# Altium schematic sheet USBC-UART.SchDoc
size A3; SheetNumber: 2; SheetTotal: 5
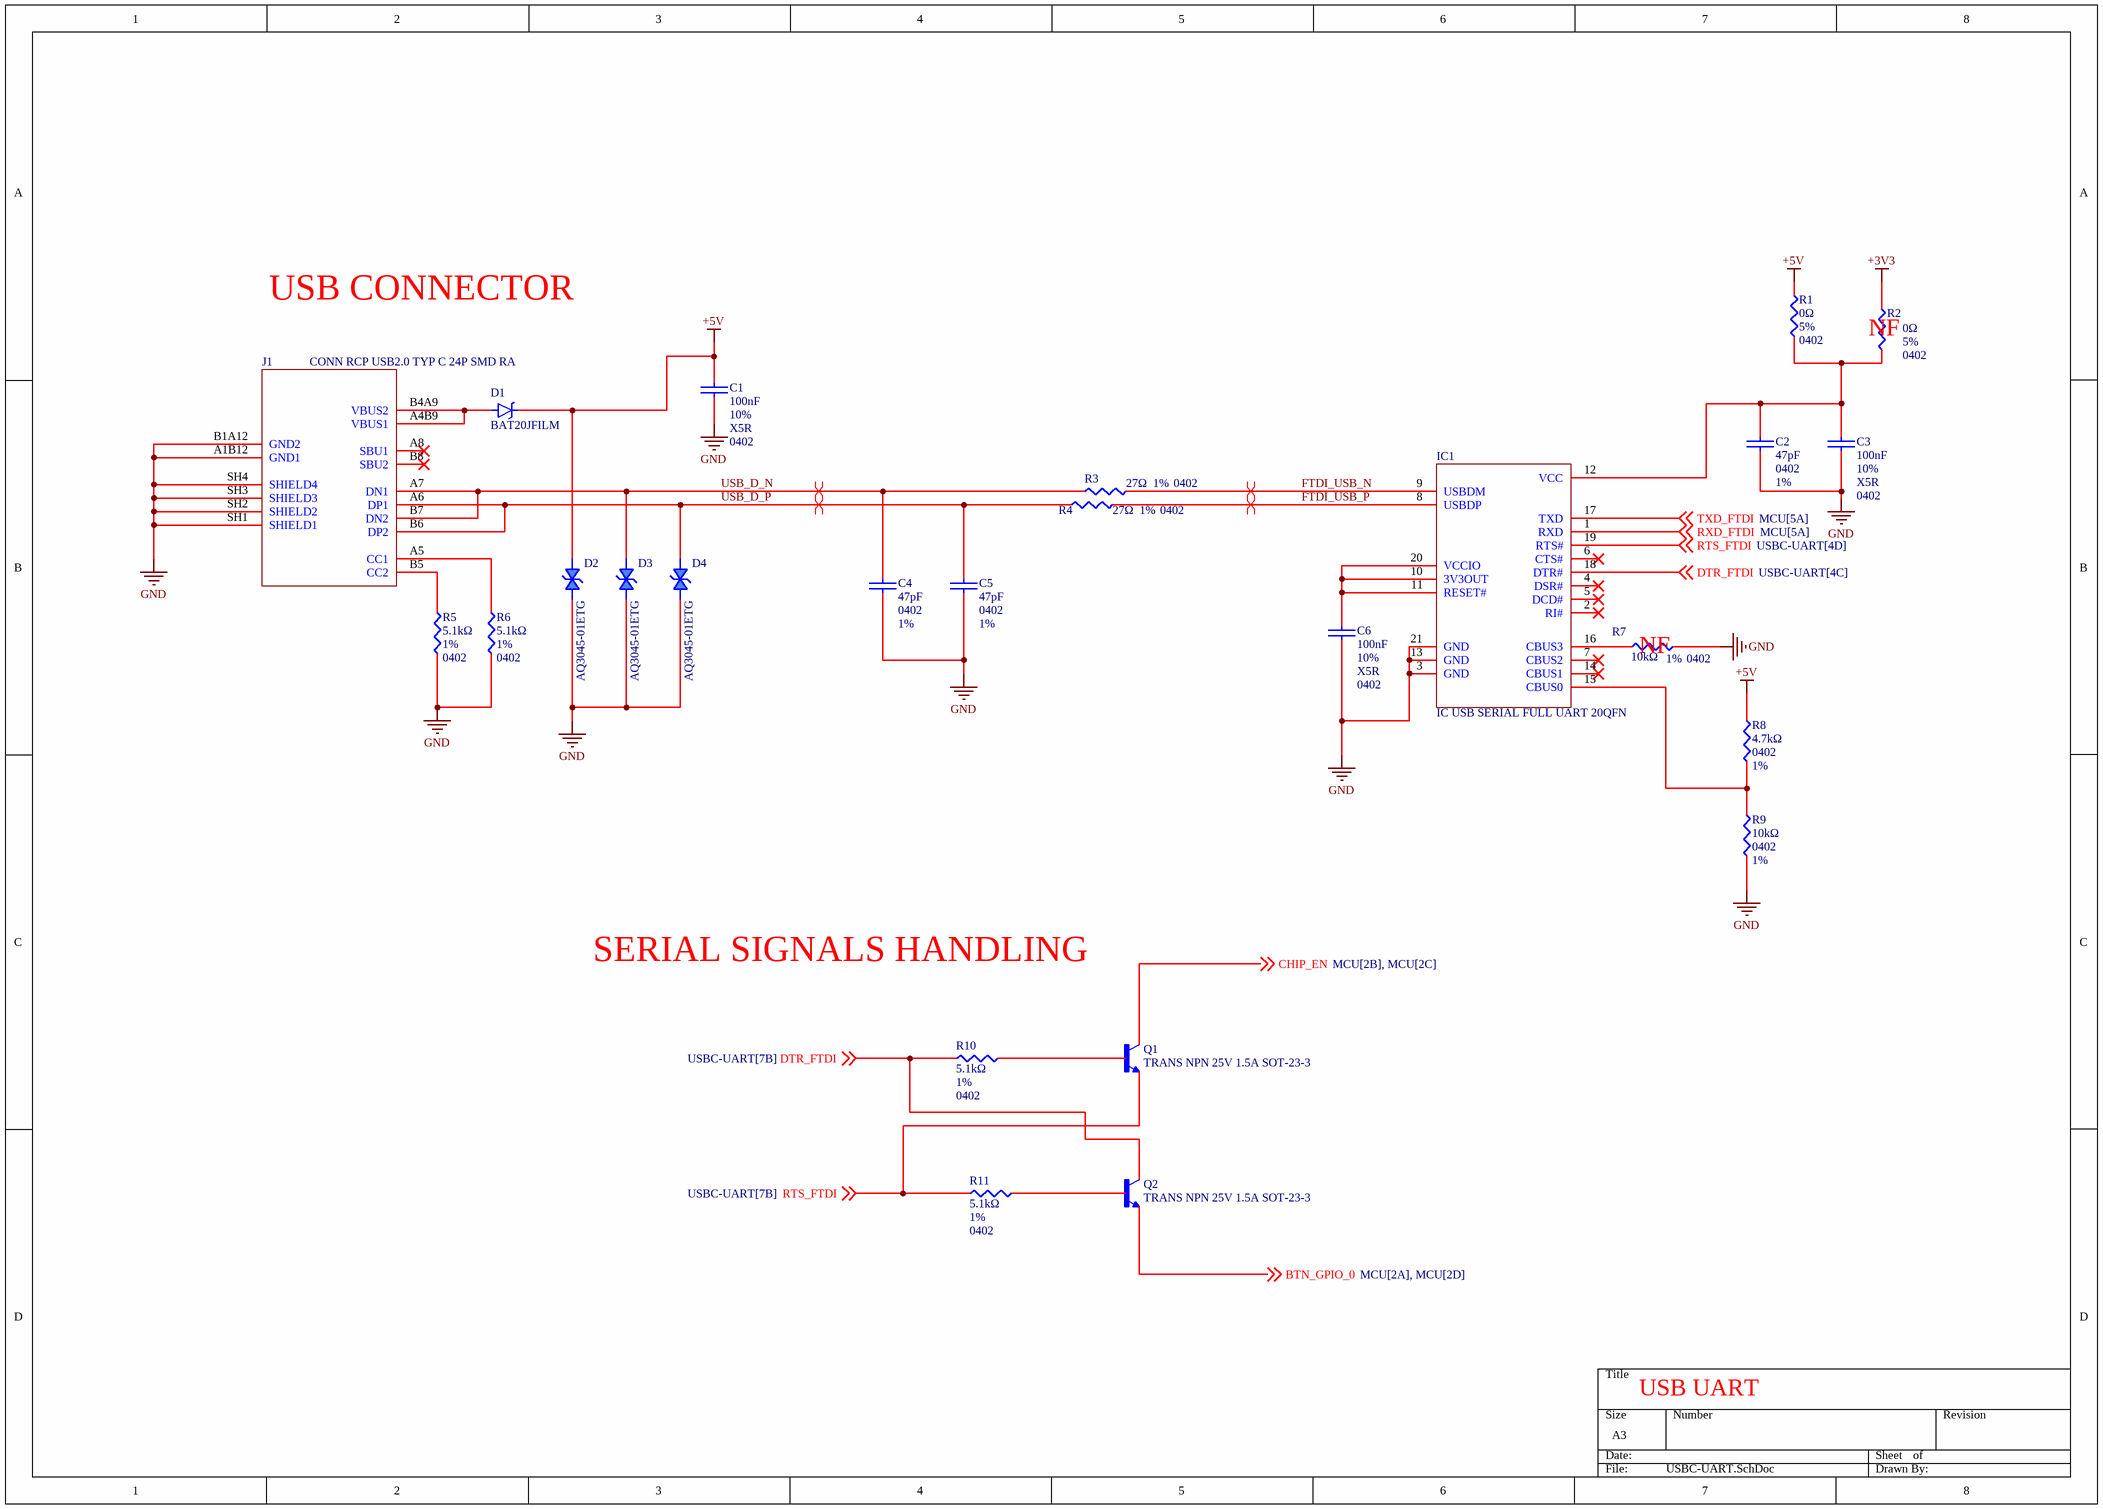
[diagram p0: USBC-UART.SchDoc]

## Parts
C1  value 100nF  Tolerance: 10%  Dielectric: X5R  Case/Package: 0402  [C0402]  (hidden comment: CAP CER 100nF 50V X5R 0402)
C2  value 47pF  Case/Package: 0402  Tolerance: 1%  [C0402]  (hidden comment: CAP CER 47PF 50V C0G/NPO 0402)
C3  value 100nF  Tolerance: 10%  Dielectric: X5R  Case/Package: 0402  [C0402]  (hidden comment: CAP CER 100nF 50V X5R 0402)
C4  value 47pF  Case/Package: 0402  Tolerance: 1%  [C0402]  (hidden comment: CAP CER 47PF 50V C0G/NPO 0402)
C5  value 47pF  Case/Package: 0402  Tolerance: 1%  [C0402]  (hidden comment: CAP CER 47PF 50V C0G/NPO 0402)
C6  value 100nF  Tolerance: 10%  Dielectric: X5R  Case/Package: 0402  [C0402]  (hidden comment: CAP CER 100nF 50V X5R 0402)
D1  BAT20JFILM  [SOD-323]
D2  TVS DIODE 5.3VWM 12VC SOD882  [RTVS_SOD882_LTF-L]  (value not drawn)
D3  TVS DIODE 5.3VWM 12VC SOD882  [RTVS_SOD882_LTF-L]  (value not drawn)
D4  TVS DIODE 5.3VWM 12VC SOD882  [RTVS_SOD882_LTF-L]  (value not drawn)
IC1  IC USB SERIAL FULL UART 20QFN  [QFN50P400X400X80-21N]
J1  CONN RCP USB2.0 TYP C 24P SMD RA  [MOLEX_2171790001]
Q1  TRANS NPN 25V 1.5A SOT-23-3  [TRANS_SS8050-G]
Q2  TRANS NPN 25V 1.5A SOT-23-3  [TRANS_SS8050-G]
R1  value 0Ω  Tolerance: 5%  Case/Package: 0402  [R0402]  (hidden comment: RES 0 OHM JUMPER 1/16W 0402)
R2  value 0Ω  Tolerance: 5%  Case/Package: 0402  [R0402]  (hidden comment: RES 0 OHM JUMPER 1/16W 0402)
R3  value 27Ω  Tolerance: 1%  Case/Package: 0402  [R0402]  (hidden comment: RES SMD 27 OHM 1% 1/16W 0402)
R4  value 27Ω  Tolerance: 1%  Case/Package: 0402  [R0402]  (hidden comment: RES SMD 27 OHM 1% 1/16W 0402)
R5  value 5.1kΩ  Tolerance: 1%  Case/Package: 0402  [R0402]  (hidden comment: RES 5.1kΩ ±1% 62.5mW 0402)
R6  value 5.1kΩ  Tolerance: 1%  Case/Package: 0402  [R0402]  (hidden comment: RES 5.1kΩ ±1% 62.5mW 0402)
R7  value 10kΩ  Case/Package: 0402  Tolerance: 1%  [R0402]  (hidden comment: RES SMD 10K OHM 1% 1/16W 0402)
R8  value 4.7kΩ  Case/Package: 0402  Tolerance: 1%  [R0402]  (hidden comment: RES SMD 4.7K OHM 1% 1/16W 0402)
R9  value 10kΩ  Case/Package: 0402  Tolerance: 1%  [R0402]  (hidden comment: RES SMD 10K OHM 1% 1/16W 0402)
R10  value 5.1kΩ  Tolerance: 1%  Case/Package: 0402  [R0402]  (hidden comment: RES 5.1kΩ ±1% 62.5mW 0402)
R11  value 5.1kΩ  Tolerance: 1%  Case/Package: 0402  [R0402]  (hidden comment: RES 5.1kΩ ±1% 62.5mW 0402)

## Nets
+3V3: R2.2
+5V: C1.2 D1.C D2.2 R1.2 R8.2
GND: C1.1 C2.1 C3.1 C4.1 C5.1 C6.1 D2.1 D3.2 D4.2 IC1.3(GND) IC1.13(GND) IC1.21(GND) J1.A1B12(GND1) J1.B1A12(GND2) J1.SH1(SHIELD1) J1.SH2(SHIELD2) J1.SH3(SHIELD3) J1.SH4(SHIELD4) R5.2 R6.2 R7.1 R9.1
BTN_GPIO_0: Q2.2(E) ; off-sheet BTN_GPIO_0
CHIP_EN: Q1.3(C) ; off-sheet CHIP_EN
DTR_FTDI: IC1.18(DTR#) Q2.3(C) R10.1 ; off-sheet DTR_FTDI
FTDI_USB_N: IC1.9(USBDM) R3.2
FTDI_USB_P: IC1.8(USBDP) R4.2
RTS_FTDI: IC1.19(RTS#) Q1.2(E) R11.1 ; off-sheet RTS_FTDI
RXD_FTDI: IC1.1(RXD) ; off-sheet RXD_FTDI
TXD_FTDI: IC1.17(TXD) ; off-sheet TXD_FTDI
USB_D_N: C4.2 D3.1 J1.A7(DN1) J1.B7(DN2) R3.1
USB_D_P: C5.2 D4.1 J1.A6(DP1) J1.B6(DP2) R4.1
NetC2_2: C2.2 C3.2 IC1.12(VCC) R1.1 R2.1
NetC6_2: C6.2 IC1.10(3V3OUT) IC1.11(RESET#) IC1.20(VCCIO)
NetD1_A: D1.A J1.A4B9(VBUS1) J1.B4A9(VBUS2)
NetIC1_15: IC1.15(CBUS0) R8.1 R9.2
NetIC1_16: IC1.16(CBUS3) R7.2
NetJ1_A5: J1.A5(CC1) R6.1
NetJ1_B5: J1.B5(CC2) R5.1
NetQ1_1: Q1.1(B) R10.2
NetQ2_1: Q2.1(B) R11.2

Not connected (* = marked no-connect by the designer): IC1 2(RI#)* 4(DSR#)* 5(DCD#)* 6(CTS#)* 7(CBUS2)* 14(CBUS1)*; J1 A8(SBU1)* B8(SBU2)*

## Layout directives
differential pair: FTDI_USB_N, FTDI_USB_P, USB_D_N, USB_D_P

## Notes on the sheet
- USB CONNECTOR
- (near R2) NF
- (near R7) NF
- SERIAL SIGNALS HANDLING
- USB UART

## Library data of the parts
C1 C3 C6 = CC0402KRX5R9BB104: 50V 100nF X5R ±10% 0402 Multilayer Ceramic Capacitors MLCC - SMD/SMT ROHS; Manufacturer: Yageo Group; Temperature Coefficient: 30ppm/°C; Supplier: DigiKey; Supplier Part Number: 311-3342-2-ND; Manufacturer Part Number: CC0402KRX5R9BB104; RoHS: Compliant; Category: Ceramic Capacitors; Stock: 2840000; Pricing: 10000=0,00742, 20000=0,00677, 30000=0,00644, 50000=0,00608, 70000=0,00587, 100000=0,00567 (USD); China RoHS: Compliant; Country of Origin: Mainland China, Taiwan; Dielectric Material: Ceramic; Export Control Classification Number (ECCN) Code: EAR99; Halogen Free: Halogen Free; Height: 500µm; Harmonized Tariff Schedule (HTS) Code: 8532.24.00.20; Introduction Date: 2013-02-05; Lead Free: Lead Free; Length: 1mm; Lifecycle Status: Production; Material: Ceramic; Max Operating Temperature: 85°C; Min Operating Temperature: -55°C; Mounting Technology: Surface Mount; Number of Terminals: 2; REACH SVHC: Yes; Schedule B: 8532240020, 8532240020|8532240020|8532240020|8532240020|8532240020|8532240020|8532240020|8532240020|8532240020|8532240020|8532240020|8532240020|8532240020|8532240020|8532240020|8532240020|8532240020|8532240020|8532240020|8532240020|8532240020|8532240020|8532240020|85; Thickness: 558.8µm; Voltage Rating: 50V; Voltage Rating (DC): 50V; Width: 500µm; ComponentLink1URL: https://datasheet.octopart.com:443/CC0402KRX5R9BB104-Yageo-datasheet-170350636.pdf?src-supplier=IHS; ComponentLink1Description: https://datasheet.octopart.com:443/CC0402KRX5R9BB104-Yageo-datasheet-170350636.pdf?src-supplier=IHS; ComponentLink2URL: https://datasheet.octopart.com:443/CC0402KRX5R9BB104-Yageo-datasheet-78855684.pdf?src-supplier=Upverter; ComponentLink2Description: https://datasheet.octopart.com:443/CC0402KRX5R9BB104-Yageo-datasheet-78855684.pdf?src-supplier=Upverter; ComponentLink3URL: https://datasheet.octopart.com:443/CC0402KRX5R9BB104-Yageo-datasheet-140260304.pdf?src-supplier=Newark; ComponentLink3Description: https://datasheet.octopart.com:443/CC0402KRX5R9BB104-Yageo-datasheet-140260304.pdf?src-supplier=Newark; ComponentLink4URL: https://datasheet.octopart.com:443/CC0402KRX5R9BB104-Yageo-datasheet-158238148.pdf?src-supplier=Newark; ComponentLink4Description: https://datasheet.octopart.com:443/CC0402KRX5R9BB104-Yageo-datasheet-158238148.pdf?src-supplier=Newark; ComponentLink5URL: https://datasheet.octopart.com:443/CC0402KRX5R9BB104-Yageo-datasheet-182029422.pdf?src-supplier=Farnell; ComponentLink5Description: https://datasheet.octopart.com:443/CC0402KRX5R9BB104-Yageo-datasheet-182029422.pdf?src-supplier=Farnell; ComponentLink6URL: https://datasheet.octopart.com/CC0402KRX5R9BB104-Yageo-datasheet-86397281.pdf; ComponentLink6Description: https://datasheet.octopart.com/CC0402KRX5R9BB104-Yageo-datasheet-86397281.pdf; ComponentLink7URL: https://datasheet.octopart.com:443/CC0402KRX5R9BB104-Yageo-datasheet-149070021.pdf?src-supplier=TME; ComponentLink7Description: https://datasheet.octopart.com:443/CC0402KRX5R9BB104-Yageo-datasheet-149070021.pdf?src-supplier=TME; ComponentLink8URL: https://datasheet.octopart.com:443/CC0402KRX5R9BB104-Yageo-Group-datasheet-145016144.pdf?src-supplier=ODG+(Origin+Data+Global); ComponentLink8Description: https://datasheet.octopart.com:443/CC0402KRX5R9BB104-Yageo-Group-datasheet-145016144.pdf?src-supplier=ODG+(Origin+Data+Global); ComponentLink9URL: https://datasheet.octopart.com:443/CC0402KRX5R9BB104-Yageo-datasheet-137875056.pdf?src-supplier=Future+Electronics; ComponentLink9Description: https://datasheet.octopart.com:443/CC0402KRX5R9BB104-Yageo-datasheet-137875056.pdf?src-supplier=Future+Electronics; ComponentLink10URL: https://datasheet.octopart.com:443/CC0402KRX5R9BB104-Yageo-datasheet-137700085.pdf?src-supplier=Future+Electronics; ComponentLink10Description: https://datasheet.octopart.com:443/CC0402KRX5R9BB104-Yageo-datasheet-137700085.pdf?src-supplier=Future+Electronics; ComponentLink11URL: https://datasheet.octopart.com:443/CC0402KRX5R9BB104-Yageo-datasheet-62067349.pdf?src-supplier=Future+Electronics; ComponentLink11Description: https://datasheet.octopart.com:443/CC0402KRX5R9BB104-Yageo-datasheet-62067349.pdf?src-supplier=Future+Electronics; ComponentLink12URL: https://datasheet.octopart.com:443/CC0402KRX5R9BB104-Yageo-datasheet-68071816.pdf?src-supplier=Future+Electronics; ComponentLink12Description: https://datasheet.octopart.com:443/CC0402KRX5R9BB104-Yageo-datasheet-68071816.pdf?src-supplier=Future+Electronics; ComponentLink13URL: https://datasheet.octopart.com:443/CC0402KRX5R9BB104-Yageo-datasheet-68297942.pdf?src-supplier=Future+Electronics; ComponentLink13Description: https://datasheet.octopart.com:443/CC0402KRX5R9BB104-Yageo-datasheet-68297942.pdf?src-supplier=Future+Electronics; ComponentLink14URL: http://sigma.octopart.com:80/conflict_mineral_statement/Yageo-company-3.pdf?src-supplier=Compliance+Statements; ComponentLink14Description: http://sigma.octopart.com:80/conflict_mineral_statement/Yageo-company-3.pdf?src-supplier=Compliance+Statements; ComponentLink15URL: http://sigma.octopart.com:80/rohs_statement/Yageo-company-2.pdf?src-supplier=Compliance+Statements; ComponentLink15Description: http://sigma.octopart.com:80/rohs_statement/Yageo-company-2.pdf?src-supplier=Compliance+Statements; LCSC Part: C105882
C2 C4 C5 = CC0402FRNPO9BN470: 50V 47pF NP0 ±1% 0402 Multilayer Ceramic Capacitors MLCC - SMD/SMT ROHS; Manufacturer: Yageo Group; Dielectric: C0G; Supplier: DigiKey; Supplier Part Number: 311-1646-1-ND; Manufacturer Part Number: CC0402FRNPO9BN470; RoHS: Compliant; Category: Ceramic Capacitors; Stock: 93603; Pricing: 1=0,1, 10=0,05, 50=0,034, 100=0,0292, 500=0,02122, 1000=0,01878, 2500=0,01622, 5000=0,01467 (USD); Case Code (Imperial): 0402; Case Code (Metric): 1005; China RoHS: Compliant; Composition: Ceramic; Depth: 500µm; Dielectric Material: Ceramic; Halogen Free: Halogen Free; Height: 500µm; Lead Free: Lead Free; Length: 1mm; Lifecycle Status: Production; Max Operating Temperature: 125°C; Min Operating Temperature: -55°C; Mounting Technology: Surface Mount; Number of Terminals: 2; Packaging: Tape and Reel; Radiation Hardening: No; REACH SVHC: Yes; Schedule B: 8532240020, 8532240020|8532240020|8532240020|8532240020|8532240020; Termination: SMD/SMT; Thickness: 558.8µm; Voltage Rating: 50V; Voltage Rating (DC): 50V; Weight: 652.039032µg; Width: 500µm; ComponentLink1URL: https://datasheet.octopart.com:443/CC0402FRNPO9BN470-Yageo-datasheet-182140217.pdf?src-supplier=IHS; ComponentLink1Description: https://datasheet.octopart.com:443/CC0402FRNPO9BN470-Yageo-datasheet-182140217.pdf?src-supplier=IHS; ComponentLink2URL: https://datasheet.octopart.com:443/CC0402FRNPO9BN470-Yageo-datasheet-181966869.pdf?src-supplier=Newark; ComponentLink2Description: https://datasheet.octopart.com:443/CC0402FRNPO9BN470-Yageo-datasheet-181966869.pdf?src-supplier=Newark; ComponentLink3URL: https://datasheet.octopart.com:443/CC0402FRNPO9BN470-Yageo-datasheet-181966868.pdf?src-supplier=Newark; ComponentLink3Description: https://datasheet.octopart.com:443/CC0402FRNPO9BN470-Yageo-datasheet-181966868.pdf?src-supplier=Newark; ComponentLink4URL: https://datasheet.octopart.com:443/CC0402FRNPO9BN470-Yageo-datasheet-151948684.pdf?src-supplier=element14+APAC; ComponentLink4Description: https://datasheet.octopart.com:443/CC0402FRNPO9BN470-Yageo-datasheet-151948684.pdf?src-supplier=element14+APAC; ComponentLink5URL: https://datasheet.octopart.com:443/CC0402FRNPO9BN470-Yageo-datasheet-137875056.pdf?src-supplier=Future+Electronics; ComponentLink5Description: https://datasheet.octopart.com:443/CC0402FRNPO9BN470-Yageo-datasheet-137875056.pdf?src-supplier=Future+Electronics; ComponentLink6URL: https://datasheet.octopart.com:443/CC0402FRNPO9BN470-Yageo-datasheet-136957424.pdf?src-supplier=Future+Electronics; ComponentLink6Description: https://datasheet.octopart.com:443/CC0402FRNPO9BN470-Yageo-datasheet-136957424.pdf?src-supplier=Future+Electronics; ComponentLink7URL: https://datasheet.octopart.com:443/CC0402FRNPO9BN470-Yageo-datasheet-137700082.pdf?src-supplier=Future+Electronics; ComponentLink7Description: https://datasheet.octopart.com:443/CC0402FRNPO9BN470-Yageo-datasheet-137700082.pdf?src-supplier=Future+Electronics; ComponentLink8URL: https://datasheet.octopart.com:443/CC0402FRNPO9BN470-Yageo-datasheet-78855684.pdf?src-supplier=Future+Electronics; ComponentLink8Description: https://datasheet.octopart.com:443/CC0402FRNPO9BN470-Yageo-datasheet-78855684.pdf?src-supplier=Future+Electronics; ComponentLink9URL: https://datasheet.octopart.com:443/CC0402FRNPO9BN470-Yageo-datasheet-16730043.pdf?src-supplier=Future+Electronics; ComponentLink9Description: https://datasheet.octopart.com:443/CC0402FRNPO9BN470-Yageo-datasheet-16730043.pdf?src-supplier=Future+Electronics; ComponentLink10URL: https://datasheet.octopart.com:443/CC0402FRNPO9BN470-Yageo-datasheet-12589826.pdf?src-supplier=Future+Electronics; ComponentLink10Description: https://datasheet.octopart.com:443/CC0402FRNPO9BN470-Yageo-datasheet-12589826.pdf?src-supplier=Future+Electronics; ComponentLink11URL: https://datasheet.octopart.com:443/CC0402FRNPO9BN470-Yageo-datasheet-10406438.pdf?src-supplier=Future+Electronics; ComponentLink11Description: https://datasheet.octopart.com:443/CC0402FRNPO9BN470-Yageo-datasheet-10406438.pdf?src-supplier=Future+Electronics; ComponentLink12URL: https://datasheet.octopart.com:443/CC0402FRNPO9BN470-Yageo-datasheet-8817079.pdf?src-supplier=Future+Electronics; ComponentLink12Description: https://datasheet.octopart.com:443/CC0402FRNPO9BN470-Yageo-datasheet-8817079.pdf?src-supplier=Future+Electronics; ComponentLink13URL: https://datasheet.octopart.com:443/CC0402FRNPO9BN470-Yageo-datasheet-8324240.pdf?src-supplier=Future+Electronics; ComponentLink13Description: https://datasheet.octopart.com:443/CC0402FRNPO9BN470-Yageo-datasheet-8324240.pdf?src-supplier=Future+Electronics; ComponentLink14URL: https://datasheet.octopart.com:443/CC0402FRNPO9BN470-Yageo-datasheet-504625.pdf?src-supplier=Future+Electronics; ComponentLink14Description: https://datasheet.octopart.com:443/CC0402FRNPO9BN470-Yageo-datasheet-504625.pdf?src-supplier=Future+Electronics; ComponentLink15URL: https://datasheet.octopart.com:443/CC0402FRNPO9BN470-Yageo-datasheet-5321569.pdf?src-supplier=Future+Electronics; ComponentLink15Description: https://datasheet.octopart.com:443/CC0402FRNPO9BN470-Yageo-datasheet-5321569.pdf?src-supplier=Future+Electronics; ComponentLink16URL: http://sigma.octopart.com:80/conflict_mineral_statement/Yageo-company-3.pdf?src-supplier=Compliance+Statements; ComponentLink16Description: http://sigma.octopart.com:80/conflict_mineral_statement/Yageo-company-3.pdf?src-supplier=Compliance+Statements; ComponentLink17URL: http://sigma.octopart.com:80/rohs_statement/Yageo-company-2.pdf?src-supplier=Compliance+Statements; ComponentLink17Description: http://sigma.octopart.com:80/rohs_statement/Yageo-company-2.pdf?src-supplier=Compliance+Statements; LCSC Part: C277503
D1 = BAT20JFILM: BAT20J Series 23 V 1 A Surface Mount Switching Schottky Diode - SOD-323; Manufacturer: STMicroelectronics; Average Rectified Current: 1A; Value: 20pF; Element Configuration: Single; Forward Voltage: 310mV; Max Forward Surge Current (Ifsm): 5A; Max Junction Temperature (Tj): 150°C; Max Repetitive Reverse Voltage (Vrrm): 23V; Max Reverse Leakage Current: 12µA; Number of Elements: 1; Polarity: Standard; Reverse Standoff Voltage: 15V; Supplier: DigiKey; Supplier Part Number: 497-3381-1-ND; Manufacturer Part Number: BAT20JFILM; RoHS: Compliant; Category: Schottky Diodes; Stock: 647; Pricing: 1=0,34, 10=0,206, 100=0,129, 500=0,09552, 1000=0,08468 (USD); China RoHS: Compliant; Country of Origin: Mainland China; Current Rating: 1A; Export Control Classification Number (ECCN) Code: EAR99; Forward Current: 1A; Height: 1.13mm; Harmonized Tariff Schedule (HTS) Code: 8541.10.00.80; Introduction Date: 2004-04-02; Lead Free: Lead Free; Length: 1.8mm; Lifecycle Status: Production; Max Operating Temperature: 150°C; Max Output current: 1A; Max Reverse Voltage (DC): 23V; Max Surge Current: 5A; Min Operating Temperature: -65°C; Mounting Technology: Surface Mount; Pins: 2; Number of Terminals: 2; Output Current: 1A; Packaging: Tape and Reel; Peak Non-Repetitive Surge Current: 5A; Peak Reverse Current: 12µA; Radiation Hardening: No; REACH SVHC: Yes; Schedule B: 8541100080, 8541100080|8541100080|8541100080|8541100080|8541100080; Voltage Rating (DC): 23V; Weight: 4.535924g; Width: 1.35mm; ComponentLink1URL: https://datasheet.octopart.com:443/BAT20JFILM-STMicroelectronics-datasheet-21217136.pdf?src-supplier=Upverter; ComponentLink1Description: https://datasheet.octopart.com:443/BAT20JFILM-STMicroelectronics-datasheet-21217136.pdf?src-supplier=Upverter; ComponentLink2URL: https://datasheet.octopart.com:443/BAT20JFILM-STMicroelectronics-datasheet-568812.pdf?src-supplier=STMicroelectronics; ComponentLink2Description: https://datasheet.octopart.com:443/BAT20JFILM-STMicroelectronics-datasheet-568812.pdf?src-supplier=STMicroelectronics; ComponentLink3URL: https://datasheet.octopart.com:443/BAT20JFILM-STMicroelectronics-datasheet-74075.pdf?src-supplier=DigiKey; ComponentLink3Description: https://datasheet.octopart.com:443/BAT20JFILM-STMicroelectronics-datasheet-74075.pdf?src-supplier=DigiKey; ComponentLink4URL: https://datasheet.octopart.com:443/BAT20JFILM-STMicroelectronics-datasheet-14054137.pdf?src-supplier=iiiC; ComponentLink4Description: https://datasheet.octopart.com:443/BAT20JFILM-STMicroelectronics-datasheet-14054137.pdf?src-supplier=iiiC; LCSC Part: C155590
D2-D4 = AQ3045-01ETG: Bi 30Kv 5V 0.35Pf Automotve Tvs Sod882/ T&r Rohs Compliant: Yes |Littelfuse AQ3045-01ETG; Breakdown Voltage: 7.8V; Clamping Voltage: 12V; Leakage Current: 100nA; Max Breakdown Voltage: 9V; Min Breakdown Voltage: 6.8V; Number of Channels: 1; Operating Supply Voltage: 5.3V; Peak Pulse Power: 40W; Polarity: Bidirectional; Supplier: DigiKey; Supplier Part Number: F9321CT-ND; Manufacturer: Littelfuse; RoHS: Compliant; Category: TVS Diodes; Stock: 799; Pricing: 1=0,69, 10=0,424, 100=0,2714, 500=0,20548, 1000=0,18418, 2000=0,16625, 5000=0,14682 (USD); Lifecycle Status: Production; Max Operating Temperature: 150°C; Min Operating Temperature: -40°C; Mounting Technology: Surface Mount; Number of Elements: 1; Number of Terminals: 2; Packaging: Cut Tape; Peak Reverse Current: 100nA; Ratings: AEC-Q101; REACH SVHC: Yes; Reverse Standoff Voltage: 5.3V; ComponentLink1URL: https://datasheet.octopart.com:443/AQ3045-01ETG-Littelfuse-datasheet-180606588.pdf?src-supplier=IHS; ComponentLink1Description: https://datasheet.octopart.com:443/AQ3045-01ETG-Littelfuse-datasheet-180606588.pdf?src-supplier=IHS; ComponentLink2URL: https://datasheet.octopart.com:443/AQ3045-01ETG-Littelfuse-datasheet-140480283.pdf?src-supplier=ODG+(Origin+Data+Global); ComponentLink2Description: https://datasheet.octopart.com:443/AQ3045-01ETG-Littelfuse-datasheet-140480283.pdf?src-supplier=ODG+(Origin+Data+Global); ComponentLink3URL: https://datasheet.octopart.com:443/AQ3045-01ETG-Littelfuse-datasheet-101609968.pdf?src-supplier=Farnell; ComponentLink3Description: https://datasheet.octopart.com:443/AQ3045-01ETG-Littelfuse-datasheet-101609968.pdf?src-supplier=Farnell; ComponentLink4URL: https://datasheet.octopart.com:443/AQ3045-01ETG-Littelfuse-datasheet-183003566.pdf?src-supplier=JRH+Electronics; ComponentLink4Description: https://datasheet.octopart.com:443/AQ3045-01ETG-Littelfuse-datasheet-183003566.pdf?src-supplier=JRH+Electronics; ComponentLink5URL: https://datasheet.octopart.com:443/AQ3045-01ETG-Littelfuse-datasheet-170904929.pdf?src-supplier=Future+Electronics; ComponentLink5Description: https://datasheet.octopart.com:443/AQ3045-01ETG-Littelfuse-datasheet-170904929.pdf?src-supplier=Future+Electronics; Manufacturer Part Number: AQ3045-01ETG
IC1 = FT231XQ-R: Tape & Reel (TR) 2006 UART USB 2.0 interface controller 3.3V~5V 4mm 8mA 12Mbps; Manufacturer: FTDI; Interface: UART, USB; Clock Frequency: 12.02MHz; Max Supply Current: 8.4mA; Max Supply Voltage: 5.5V; Min Supply Voltage: 2.97V; Number of Channels: 1; Operating Supply Voltage: 5V; Supplier: DigiKey; Supplier Part Number: 768-1128-6-ND; Manufacturer Part Number: FT231XQ-R; RoHS: Compliant; Category: UART Interface ICs; Pricing: 1=2,34, 25=2,27, 100=2,2, 250=2,15728 (USD); Ambient Temperature Range High: 85°C; Case/Package: QFN; Data Rate: 12Mbps; Height: 800µm; Height - Seated (Max): 800µm; Lead Free: Lead Free; Length: 4mm; Lifecycle Status: Production; Max Operating Temperature: 85°C; Min Operating Temperature: -40°C; Mounting Technology: Surface Mount; Pins: 20; Number of Terminals: 20; Operating Supply Current: 8mA; REACH SVHC: Yes; Terminal Pitch: 500µm; Weight: 123.008581mg; Width: 4mm; ComponentLink1URL: https://datasheet.octopart.com:443/FT231XQ-R-FTDI-datasheet-182343132.pdf?src-supplier=IHS; ComponentLink1Description: https://datasheet.octopart.com:443/FT231XQ-R-FTDI-datasheet-182343132.pdf?src-supplier=IHS; ComponentLink2URL: https://datasheet.octopart.com:443/FT231XQ-R-FTDI-datasheet-11021087.pdf?src-supplier=HQonline; ComponentLink2Description: https://datasheet.octopart.com:443/FT231XQ-R-FTDI-datasheet-11021087.pdf?src-supplier=HQonline; ComponentLink3URL: https://datasheet.octopart.com:443/FT231XQ-R-FTDI-datasheet-28834672.pdf?src-supplier=SOS+electronic; ComponentLink3Description: https://datasheet.octopart.com:443/FT231XQ-R-FTDI-datasheet-28834672.pdf?src-supplier=SOS+electronic; ComponentLink4URL: https://datasheet.octopart.com:443/FT231XQ-R-FTDI-datasheet-68321328.pdf?src-supplier=TME; ComponentLink4Description: https://datasheet.octopart.com:443/FT231XQ-R-FTDI-datasheet-68321328.pdf?src-supplier=TME; ComponentLink5URL: https://datasheet.octopart.com:443/FT231XQ-R-FTDI-datasheet-134530624.pdf?src-supplier=SHENGYU+ELECTRONICS; ComponentLink5Description: https://datasheet.octopart.com:443/FT231XQ-R-FTDI-datasheet-134530624.pdf?src-supplier=SHENGYU+ELECTRONICS; LCSC Part: C132159
J1 = 217179-0001: USB Connector, USB Type C, USB 2.0, Receptacle, 16 Ways, Surface Mount, Through Hole Mount; Manufacturer: Molex; Contact Resistance: 50mΩ; Current Rating: 1.25A; Dielectric Material: Polyamide; Insulation Resistance: 100MΩ; Number of Contacts: 16; Number of Ports: 1; Voltage Rating: 30V; Supplier: DigiKey; Supplier Part Number: 900-2171790001DKR-ND; Manufacturer Part Number: 217179-0001; RoHS: Compliant; Category: USB Connectors; Stock: 39285; Pricing: 1=0,83, 10=0,704, 25=0,6596, 50=0,628, 100=0,598, 250=0,56052, 500=0,53374 (USD); China RoHS: Compliant; Contact Gender: Female; Contact Material: Gold, Nickel; Country of Origin: Mainland China; Export Control Classification Number (ECCN) Code: EAR99; Gender: Receptacle; Height: 3.36mm; Harmonized Tariff Schedule (HTS) Code: 8536.69.40.30; Introduction Date: 2021-08-30; Lifecycle Status: Production; Max Operating Temperature: 85°C; Min Operating Temperature: -40°C; Pins: 16; Number of Rows: 1; REACH SVHC: Yes; Shell Finish: Nickel; Shell Material: Stainless Steel; Terminal Pitch: 500µm; USB Standard: USB 2.0; ComponentLink1URL: https://datasheet.octopart.com:443/217179-0001-Molex-datasheet-158871109.pdf?src-supplier=ODG+(Origin+Data+Global); ComponentLink1Description: https://datasheet.octopart.com:443/217179-0001-Molex-datasheet-158871109.pdf?src-supplier=ODG+(Origin+Data+Global); ComponentLink2URL: https://sigma.octopart.com:443/158871110/technical_drawing/Molex-217179-0001.pdf?src-supplier=Upverter; ComponentLink2Description: https://sigma.octopart.com:443/158871110/technical_drawing/Molex-217179-0001.pdf?src-supplier=Upverter; ComponentLink3URL: https://datasheet.octopart.com:443/217179-0001-Molex-datasheet-164573281.pdf?src-supplier=RS+(Formerly+Allied+Electronics); ComponentLink3Description: https://datasheet.octopart.com:443/217179-0001-Molex-datasheet-164573281.pdf?src-supplier=RS+(Formerly+Allied+Electronics); ComponentLink4URL: http://sigma.octopart.com:80/reach_statement/Molex-company-74.pdf?src-supplier=Compliance+Statements; ComponentLink4Description: http://sigma.octopart.com:80/reach_statement/Molex-company-74.pdf?src-supplier=Compliance+Statements; ComponentLink5URL: http://sigma.octopart.com:80/rohs_statement/Molex-company-73.pdf?src-supplier=Compliance+Statements; ComponentLink5Description: http://sigma.octopart.com:80/rohs_statement/Molex-company-73.pdf?src-supplier=Compliance+Statements; ComponentLink6URL: http://sigma.octopart.com:80/conflict_mineral_statement/Molex-company-72.pdf?src-supplier=Compliance+Statements; ComponentLink6Description: http://sigma.octopart.com:80/conflict_mineral_statement/Molex-company-72.pdf?src-supplier=Compliance+Statements; LCSC Part: 2171790001
Q1 Q2 = SS8050-G: TRANS NPN 25V 1.5A SOT23-3 / Bipolar (BJT) Transistor NPN 25 V 1.5 A 100MHz 300 mW Surface Mount SOT-23-3; Manufacturer: Comchip; Collector Base Voltage (VCBO): 40V; Collector Emitter Saturation Voltage: 500mV; Emitter Base Voltage (VEBO): 5V; hFE Min: 40; Max Junction Temperature (Tj): 150°C; Max Power Dissipation: 300mW; Number of Elements: 1; Supplier: DigiKey; Supplier Part Number: 641-1790-1-ND; Manufacturer Part Number: SS8050-G; RoHS: Compliant; Category: BJTs; Stock: 85486; Pricing: 1=0,24, 10=0,148, 100=0,0921, 500=0,06754, 1000=0,05958 (USD); Case/Package: TO-236-3; Collector Emitter Breakdown Voltage: 25V; Collector Emitter Voltage (VCEO): 25V; Height: 1.15mm; Lifecycle Status: Production; Max Breakdown Voltage: 25V; Max Collector Current: 1.5A; Max Operating Temperature: 150°C; Mounting Technology: Surface Mount; Number of Terminals: 3; Power Dissipation: 300mW; REACH SVHC: Yes; Schedule B: 8541100070|8541100070|8541100070|8541100070|8541100070; Transition Frequency: 100MHz; ComponentLink1URL: https://datasheet.octopart.com:443/SS8050-G-Comchip-datasheet-180131983.pdf?src-supplier=IHS; ComponentLink1Description: https://datasheet.octopart.com:443/SS8050-G-Comchip-datasheet-180131983.pdf?src-supplier=IHS; ComponentLink2URL: https://datasheet.octopart.com:443/SS8050-G-Comchip-datasheet-155422643.pdf?src-supplier=Upverter; ComponentLink2Description: https://datasheet.octopart.com:443/SS8050-G-Comchip-datasheet-155422643.pdf?src-supplier=Upverter; ComponentLink3URL: https://datasheet.octopart.com:443/SS8050-G-Comchip-datasheet-189767092.pdf?src-supplier=ODG+(Origin+Data+Global); ComponentLink3Description: https://datasheet.octopart.com:443/SS8050-G-Comchip-datasheet-189767092.pdf?src-supplier=ODG+(Origin+Data+Global); LCSC Part: C3199946
R1 R2 = RC0402JR-070RL: GENERAL PURPOSE CHIP RESISTOR Metal Glaze/thick Film, 0.0625W, 0ohm, Surface Mount, 0402; Manufacturer: Yageo Group; Max Power Dissipation: 63mW; Power Dissipation: 62.5mW; Temperature Coefficient: 200ppm/°C; Voltage Rating: 50V; Supplier: DigiKey; Supplier Part Number: 311-0.0JRCT-ND; Manufacturer Part Number: RC0402JR-070RL; RoHS: Compliant; Category: Chip SMD Resistors; Stock: 12915395; Pricing: 1=0,1, 10=0,010, 25=0,0064, 50=0,0054, 100=0,0047, 250=0,00392, 500=0,00346, 1000=0,00304, 5000=0,0023 (USD); Case Code (Imperial): 0402; China RoHS: Non-Compliant; Composition: Thick Film; Contact Plating: Tin; Depth: 500µm; Features: Moisture Resistant; Height: 350µm; Lead Free: Lead Free; Length: 1mm; Lifecycle Status: Production; Max Operating Temperature: 155°C; Military Standard: Not; Min Operating Temperature: -55°C; Mounting Technology: Surface Mount; Pins: 2; Number of Terminals: 2; Number of Terminations: 2; Packaging: Tape & Reel; Power Rating: 63mW; Radiation Hardening: No; REACH SVHC: Yes; Schedule B: 8533290000, 8533290000|8533290000, 8533290000|8533290000|8533290000, 8533290000|8533290000|8533290000|8533290000; Termination: SMD/SMT; Voltage Rating (DC): 50V; Width: 500µm; ComponentLink1URL: https://datasheet.octopart.com:443/RC0402JR-070RL-Yageo-datasheet-182189538.pdf?src-supplier=IHS; ComponentLink1Description: https://datasheet.octopart.com:443/RC0402JR-070RL-Yageo-datasheet-182189538.pdf?src-supplier=IHS; ComponentLink2URL: https://datasheet.octopart.com:443/RC0402JR-070RL-Yageo-datasheet-10408619.pdf?src-supplier=Newark; ComponentLink2Description: https://datasheet.octopart.com:443/RC0402JR-070RL-Yageo-datasheet-10408619.pdf?src-supplier=Newark; ComponentLink3URL: https://datasheet.octopart.com:443/RC0402JR-070RL-Yageo-Group-datasheet-181964826.pdf?src-supplier=Newark; ComponentLink3Description: https://datasheet.octopart.com:443/RC0402JR-070RL-Yageo-Group-datasheet-181964826.pdf?src-supplier=Newark; ComponentLink4URL: https://datasheet.octopart.com:443/RC0402JR-070RL-Yageo-Group-datasheet-190305687.pdf?src-supplier=Future+Electronics; ComponentLink4Description: https://datasheet.octopart.com:443/RC0402JR-070RL-Yageo-Group-datasheet-190305687.pdf?src-supplier=Future+Electronics; ComponentLink5URL: https://datasheet.octopart.com:443/RC0402JR-070RL-Yageo-datasheet-164759695.pdf?src-supplier=Future+Electronics; ComponentLink5Description: https://datasheet.octopart.com:443/RC0402JR-070RL-Yageo-datasheet-164759695.pdf?src-supplier=Future+Electronics; ComponentLink6URL: https://datasheet.octopart.com:443/RC0402JR-070RL-Yageo-datasheet-137700087.pdf?src-supplier=Future+Electronics; ComponentLink6Description: https://datasheet.octopart.com:443/RC0402JR-070RL-Yageo-datasheet-137700087.pdf?src-supplier=Future+Electronics; ComponentLink7URL: https://datasheet.octopart.com:443/RC0402JR-070RL-Yageo-datasheet-12531192.pdf?src-supplier=Seeed+Studio; ComponentLink7Description: https://datasheet.octopart.com:443/RC0402JR-070RL-Yageo-datasheet-12531192.pdf?src-supplier=Seeed+Studio; ComponentLink8URL: https://datasheet.octopart.com:443/RC0402JR-070RL-Yageo-datasheet-8324527.pdf?src-supplier=TME; ComponentLink8Description: https://datasheet.octopart.com:443/RC0402JR-070RL-Yageo-datasheet-8324527.pdf?src-supplier=TME; ComponentLink9URL: https://datasheet.octopart.com:443/RC0402JR-070RL-Yageo-datasheet-62067350.pdf?src-supplier=Farnell; ComponentLink9Description: https://datasheet.octopart.com:443/RC0402JR-070RL-Yageo-datasheet-62067350.pdf?src-supplier=Farnell; ComponentLink10URL: https://datasheet.octopart.com:443/RC0402JR-070RL-Yageo-datasheet-8329306.pdf?src-supplier=element14; ComponentLink10Description: https://datasheet.octopart.com:443/RC0402JR-070RL-Yageo-datasheet-8329306.pdf?src-supplier=element14; ComponentLink11URL: https://datasheet.octopart.com:443/RC0402JR-070RL-Yageo-datasheet-505231.pdf?src-supplier=element14; ComponentLink11Description: https://datasheet.octopart.com:443/RC0402JR-070RL-Yageo-datasheet-505231.pdf?src-supplier=element14; ComponentLink12URL: https://datasheet.octopart.com:443/RC0402JR-070RL-Yageo-datasheet-175423674.pdf?src-supplier=SOS+electronic; ComponentLink12Description: https://datasheet.octopart.com:443/RC0402JR-070RL-Yageo-datasheet-175423674.pdf?src-supplier=SOS+electronic; ComponentLink13URL: https://datasheet.octopart.com/RC0402JR-070RL-Yageo-datasheet-73766026.pdf; ComponentLink13Description: https://datasheet.octopart.com/RC0402JR-070RL-Yageo-datasheet-73766026.pdf; ComponentLink14URL: http://sigma.octopart.com:80/conflict_mineral_statement/Yageo-company-3.pdf?src-supplier=Compliance+Statements; ComponentLink14Description: http://sigma.octopart.com:80/conflict_mineral_statement/Yageo-company-3.pdf?src-supplier=Compliance+Statements; ComponentLink15URL: http://sigma.octopart.com:80/rohs_statement/Yageo-company-2.pdf?src-supplier=Compliance+Statements; ComponentLink15Description: http://sigma.octopart.com:80/rohs_statement/Yageo-company-2.pdf?src-supplier=Compliance+Statements; LCSC Part: C60485
R3 R4 = RT0402FRE0727RL: 62.5mW Thin Film Resistor ±50ppm/℃ ±1% 27Ω 0402 Chip Resistor - Surface Mount ROHS; Manufacturer: Yageo Group; Max Power Dissipation: 63mW; Temperature Coefficient: 50ppm/°C; Voltage Rating: 50V; Supplier: DigiKey; Supplier Part Number: YAG3343CT-ND; Manufacturer Part Number: RT0402FRE0727RL; RoHS: Compliant; Category: Chip SMD Resistors; Stock: 113870; Pricing: 1=0,1, 10=0,014, 25=0,0132, 50=0,0126, 100=0,0119, 250=0,01108, 500=0,01044, 1000=0,00987, 5000=0,00871 (USD); Case Code (Imperial): 0402; China RoHS: Non-Compliant; Composition: Thin Film; Depth: 500µm; Features: Moisture Resistant; Height: 300µm; Lead Free: Lead Free; Length: 1mm; Lifecycle Status: Production; Max Operating Temperature: 155°C; Military Standard: Not; Min Operating Temperature: -55°C; Mounting Technology: Surface Mount; Number of Terminals: 2; Number of Terminations: 2; Power Rating: 62.5mW; REACH SVHC: Yes; Schedule B: 8533210045, 8533210045|8533210045|8533210045|8533210045|8533210045; Termination: SMD/SMT; Voltage Rating (DC): 50V; Width: 500µm; Working Voltage: 50V; ComponentLink1URL: https://datasheet.octopart.com:443/RT0402FRE0727RL-Yageo-datasheet-176402239.pdf?src-supplier=Future+Electronics; ComponentLink1Description: https://datasheet.octopart.com:443/RT0402FRE0727RL-Yageo-datasheet-176402239.pdf?src-supplier=Future+Electronics; ComponentLink2URL: https://datasheet.octopart.com:443/RT0402FRE0727RL-Yageo-datasheet-169971040.pdf?src-supplier=Future+Electronics; ComponentLink2Description: https://datasheet.octopart.com:443/RT0402FRE0727RL-Yageo-datasheet-169971040.pdf?src-supplier=Future+Electronics; ComponentLink3URL: https://datasheet.octopart.com:443/RT0402FRE0727RL-Yageo-datasheet-164439670.pdf?src-supplier=Future+Electronics; ComponentLink3Description: https://datasheet.octopart.com:443/RT0402FRE0727RL-Yageo-datasheet-164439670.pdf?src-supplier=Future+Electronics; ComponentLink4URL: https://datasheet.octopart.com:443/RT0402FRE0727RL-Yageo-datasheet-96443642.pdf?src-supplier=Upverter; ComponentLink4Description: https://datasheet.octopart.com:443/RT0402FRE0727RL-Yageo-datasheet-96443642.pdf?src-supplier=Upverter; ComponentLink5URL: https://datasheet.octopart.com:443/RT0402FRE0727RL-Yageo-Group-datasheet-141265893.pdf?src-supplier=ODG+(Origin+Data+Global); ComponentLink5Description: https://datasheet.octopart.com:443/RT0402FRE0727RL-Yageo-Group-datasheet-141265893.pdf?src-supplier=ODG+(Origin+Data+Global); ComponentLink6URL: https://datasheet.octopart.com/RT0402FRE0727RL-Yageo-datasheet-86813807.pdf; ComponentLink6Description: https://datasheet.octopart.com/RT0402FRE0727RL-Yageo-datasheet-86813807.pdf; ComponentLink7URL: http://sigma.octopart.com:80/conflict_mineral_statement/Yageo-company-3.pdf?src-supplier=Compliance+Statements; ComponentLink7Description: http://sigma.octopart.com:80/conflict_mineral_statement/Yageo-company-3.pdf?src-supplier=Compliance+Statements; ComponentLink8URL: http://sigma.octopart.com:80/rohs_statement/Yageo-company-2.pdf?src-supplier=Compliance+Statements; ComponentLink8Description: http://sigma.octopart.com:80/rohs_statement/Yageo-company-2.pdf?src-supplier=Compliance+Statements
R5 R6 R10 R11 = RC0402FR-075K1L: 62.5mW Thick Film Resistors 50V ±100ppm/℃ ±1% 5.1kΩ 0402 Chip Resistor - Surface Mount ROHS; Manufacturer: Yageo Group; Max Power Dissipation: 63mW; Temperature Coefficient: 100ppm/°C; Supplier: DigiKey; Supplier Part Number: 311-5.10KLRCT-ND; Manufacturer Part Number: RC0402FR-075K1L; RoHS: Compliant; Category: Chip SMD Resistors; Stock: 480465; Pricing: 1=0,1, 10=0,021, 25=0,0148, 50=0,0118, 100=0,0095, 250=0,00728, 500=0,006, 1000=0,00502, 5000=0,00348 (USD); Case Code (Imperial): 0402; China RoHS: Non-Compliant; Composition: Thick Film; Country of Origin: Mainland China, Taiwan; Depth: 500µm; Export Control Classification Number (ECCN) Code: EAR99; Features: Moisture Resistant; Height: 350µm; Harmonized Tariff Schedule (HTS) Code: 8533.21.00.30; Introduction Date: 2008-07-18; Lead Free: Lead Free; Length: 1mm; Lifecycle Status: Production; Max Operating Temperature: 155°C; Military Standard: Not; Min Operating Temperature: -55°C; Mounting Technology: Surface Mount; Pins: 2; Number of Terminals: 2; Number of Terminations: 2; Packaging: Cut Tape; Power Dissipation: 62.5mW; Power Rating: 63mW; REACH SVHC: Yes; Schedule B: 8533210045, 8533210045|8533210045, 8533210045|8533210045|8533210045, 8533210045|8533210045|8533210045|8533210045; Termination: SMD/SMT; Voltage Rating: 50V; Voltage Rating (DC): 50V; Width: 500µm; Working Voltage: 50V; ComponentLink1URL: https://datasheet.octopart.com:443/RC0402FR-075K1L-Yageo-datasheet-175887523.pdf?src-supplier=IHS; ComponentLink1Description: https://datasheet.octopart.com:443/RC0402FR-075K1L-Yageo-datasheet-175887523.pdf?src-supplier=IHS; ComponentLink2URL: https://datasheet.octopart.com:443/RC0402FR-075K1L-Yageo-datasheet-103092701.pdf?src-supplier=Upverter; ComponentLink2Description: https://datasheet.octopart.com:443/RC0402FR-075K1L-Yageo-datasheet-103092701.pdf?src-supplier=Upverter; ComponentLink3URL: https://datasheet.octopart.com:443/RC0402FR-075K1L-Yageo-Group-datasheet-190305687.pdf?src-supplier=Future+Electronics; ComponentLink3Description: https://datasheet.octopart.com:443/RC0402FR-075K1L-Yageo-Group-datasheet-190305687.pdf?src-supplier=Future+Electronics; ComponentLink4URL: https://datasheet.octopart.com:443/RC0402FR-075K1L-Yageo-datasheet-164759695.pdf?src-supplier=Future+Electronics; ComponentLink4Description: https://datasheet.octopart.com:443/RC0402FR-075K1L-Yageo-datasheet-164759695.pdf?src-supplier=Future+Electronics; ComponentLink5URL: https://datasheet.octopart.com:443/RC0402FR-075K1L-Yageo-datasheet-137700087.pdf?src-supplier=Future+Electronics; ComponentLink5Description: https://datasheet.octopart.com:443/RC0402FR-075K1L-Yageo-datasheet-137700087.pdf?src-supplier=Future+Electronics; ComponentLink6URL: https://datasheet.octopart.com:443/RC0402FR-075K1L-Yageo-datasheet-12531192.pdf?src-supplier=Future+Electronics; ComponentLink6Description: https://datasheet.octopart.com:443/RC0402FR-075K1L-Yageo-datasheet-12531192.pdf?src-supplier=Future+Electronics; ComponentLink7URL: https://datasheet.octopart.com:443/RC0402FR-075K1L-Yageo-datasheet-505231.pdf?src-supplier=Future+Electronics; ComponentLink7Description: https://datasheet.octopart.com:443/RC0402FR-075K1L-Yageo-datasheet-505231.pdf?src-supplier=Future+Electronics; ComponentLink8URL: https://datasheet.octopart.com:443/RC0402FR-075K1L-Yageo-datasheet-10408619.pdf?src-supplier=Newark; ComponentLink8Description: https://datasheet.octopart.com:443/RC0402FR-075K1L-Yageo-datasheet-10408619.pdf?src-supplier=Newark; ComponentLink9URL: https://datasheet.octopart.com:443/RC0402FR-075K1L-Yageo-datasheet-8324527.pdf?src-supplier=Newark; ComponentLink9Description: https://datasheet.octopart.com:443/RC0402FR-075K1L-Yageo-datasheet-8324527.pdf?src-supplier=Newark; ComponentLink10URL: https://datasheet.octopart.com:443/RC0402FR-075K1L-Yageo-datasheet-62067350.pdf?src-supplier=element14+APAC; ComponentLink10Description: https://datasheet.octopart.com:443/RC0402FR-075K1L-Yageo-datasheet-62067350.pdf?src-supplier=element14+APAC; ComponentLink11URL: https://datasheet.octopart.com:443/RC0402FR-075K1L-Yageo-datasheet-148775077.pdf?src-supplier=TME; ComponentLink11Description: https://datasheet.octopart.com:443/RC0402FR-075K1L-Yageo-datasheet-148775077.pdf?src-supplier=TME; ComponentLink12URL: https://datasheet.octopart.com/RC0402FR-075K1L-Yageo-datasheet-73766026.pdf; ComponentLink12Description: https://datasheet.octopart.com/RC0402FR-075K1L-Yageo-datasheet-73766026.pdf; ComponentLink13URL: https://datasheet.octopart.com:443/RC0402FR-075K1L-Yageo-datasheet-8329306.pdf?src-supplier=element14; ComponentLink13Description: https://datasheet.octopart.com:443/RC0402FR-075K1L-Yageo-datasheet-8329306.pdf?src-supplier=element14; ComponentLink14URL: http://sigma.octopart.com:80/conflict_mineral_statement/Yageo-company-3.pdf?src-supplier=Compliance+Statements; ComponentLink14Description: http://sigma.octopart.com:80/conflict_mineral_statement/Yageo-company-3.pdf?src-supplier=Compliance+Statements; ComponentLink15URL: http://sigma.octopart.com:80/rohs_statement/Yageo-company-2.pdf?src-supplier=Compliance+Statements; ComponentLink15Description: http://sigma.octopart.com:80/rohs_statement/Yageo-company-2.pdf?src-supplier=Compliance+Statements
  R10 R11: LCSC Part: C105872
R7 R9 = AR0402FR-0710KL: Chip Resistor with Ni/Au Terminations Thick Film 0402 10kOhm 1% Paper T/R; Manufacturer: Yageo Group; Max Power Dissipation: 63mW; Power Dissipation: 62.5mW; Temperature Coefficient: 100ppm/°C; Working Voltage: 50V; Supplier: DigiKey; Supplier Part Number: 13-AR0402FR-0710KLCT-ND; Manufacturer Part Number: AR0402FR-0710KL; RoHS: Compliant; Category: Chip SMD Resistors; Stock: 19895; Pricing: 1=0,31, 10=0,166, 25=0,1348, 50=0,1166, 100=0,1023, 250=0,08796, 500=0,07968, 1000=0,0731, 5000=0,06257 (USD); China RoHS: Non-Compliant; Composition: Thick Film; Features: Moisture Resistant; Height: 350µm; Length: 1mm; Lifecycle Status: Production; Max Operating Temperature: 155°C; Min Operating Temperature: -55°C; Mounting Technology: Surface Mount; Number of Terminals: 2; Number of Terminations: 2; Packaging: Tape & Reel; REACH SVHC: Yes; Width: 500µm; ComponentLink1URL: https://datasheet.octopart.com:443/AR0402FR-0710KL-Yageo-datasheet-182189407.pdf?src-supplier=IHS; ComponentLink1Description: https://datasheet.octopart.com:443/AR0402FR-0710KL-Yageo-datasheet-182189407.pdf?src-supplier=IHS; ComponentLink2URL: https://datasheet.octopart.com/AR0402FR-0710KL-Yageo-datasheet-13033997.pdf; ComponentLink2Description: https://datasheet.octopart.com/AR0402FR-0710KL-Yageo-datasheet-13033997.pdf; ComponentLink3URL: http://sigma.octopart.com:80/conflict_mineral_statement/Yageo-company-3.pdf?src-supplier=Compliance+Statements; ComponentLink3Description: http://sigma.octopart.com:80/conflict_mineral_statement/Yageo-company-3.pdf?src-supplier=Compliance+Statements; ComponentLink4URL: http://sigma.octopart.com:80/rohs_statement/Yageo-company-2.pdf?src-supplier=Compliance+Statements; ComponentLink4Description: http://sigma.octopart.com:80/rohs_statement/Yageo-company-2.pdf?src-supplier=Compliance+Statements; LCSC Part: C4322213
R8 = AR0402FR-074K7L: Chip Resistor with Ni/Au Terminations Thick Film 0402 4.7kOhm 1% Paper T/R; Manufacturer: Yageo Group; Max Power Dissipation: 63mW; Power Dissipation: 62.5mW; Temperature Coefficient: 100ppm/°C; Working Voltage: 50V; Supplier: DigiKey; Supplier Part Number: 13-AR0402FR-074K7LCT-ND; Manufacturer Part Number: AR0402FR-074K7L; RoHS: Compliant; Category: Chip SMD Resistors; Stock: 3459; Pricing: 1=0,31, 10=0,166, 25=0,1348, 50=0,1166, 100=0,1023, 250=0,08796, 500=0,07968, 1000=0,0731, 5000=0,06257 (USD); China RoHS: Non-Compliant; Composition: Thick Film; Features: Moisture Resistant; Height: 350µm; Length: 1mm; Lifecycle Status: Production; Max Operating Temperature: 155°C; Min Operating Temperature: -55°C; Mounting Technology: Surface Mount; Number of Terminals: 2; Number of Terminations: 2; Packaging: Tape & Reel; REACH SVHC: Yes; Width: 500µm; ComponentLink1URL: https://datasheet.octopart.com:443/AR0402FR-074K7L-Yageo-Group-datasheet-182189407.pdf?src-supplier=IHS; ComponentLink1Description: https://datasheet.octopart.com:443/AR0402FR-074K7L-Yageo-Group-datasheet-182189407.pdf?src-supplier=IHS; ComponentLink2URL: https://datasheet.octopart.com:443/AR0402FR-074K7L-Yageo-datasheet-13033997.pdf?src-supplier=IHS; ComponentLink2Description: https://datasheet.octopart.com:443/AR0402FR-074K7L-Yageo-datasheet-13033997.pdf?src-supplier=IHS; ComponentLink3URL: http://sigma.octopart.com:80/conflict_mineral_statement/Yageo-company-3.pdf?src-supplier=Compliance+Statements; ComponentLink3Description: http://sigma.octopart.com:80/conflict_mineral_statement/Yageo-company-3.pdf?src-supplier=Compliance+Statements; ComponentLink4URL: http://sigma.octopart.com:80/rohs_statement/Yageo-company-2.pdf?src-supplier=Compliance+Statements; ComponentLink4Description: http://sigma.octopart.com:80/rohs_statement/Yageo-company-2.pdf?src-supplier=Compliance+Statements; LCSC Part: C4042400